# Altium schematic sheet PJ-328-5A1_PJ-328-5A.schdoc
size 127 x 101 mm
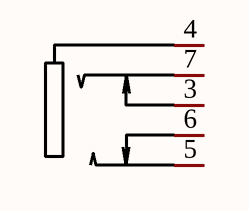
[diagram p0: PJ-328-5A1_PJ-328-5A.schdoc]

## Parts
CN?  PJ-328-5A  [AUDIO-SMD_PJ-328-5A]  (value not drawn)

## Nets

Not connected (* = marked no-connect by the designer): CN? 3 4 5 6 7

## Library data of the parts
CN? = PJ-328-5A: Manufacturer: 韩国韩荣; Add into BOM: yes; Connector Type: 3.5mm耳机座; Current Rating (Max): 500mA; Voltage Rating (Max): 30V; Symbol: PJ-328-5A; Device: PJ-328-5A; Supplier: LCSC; Supplier Part: C707231; Manufacturer Part: PJ-328-5A; JLCPCB Part Class: Extended Part; LCSC Part Name: 3.5mm耳机座; Supplier Footprint: SMD; Datasheet: https://atta.szlcsc.com/upload/public/pdf/source/20210810/0B771907E8D6964D4FE913522096DF4A.pdf; Convert to PCB: yes; Operating Temperature Range: -20℃~+70℃